# Altium project SSL_Kicker_Board_2024.PrjPcb
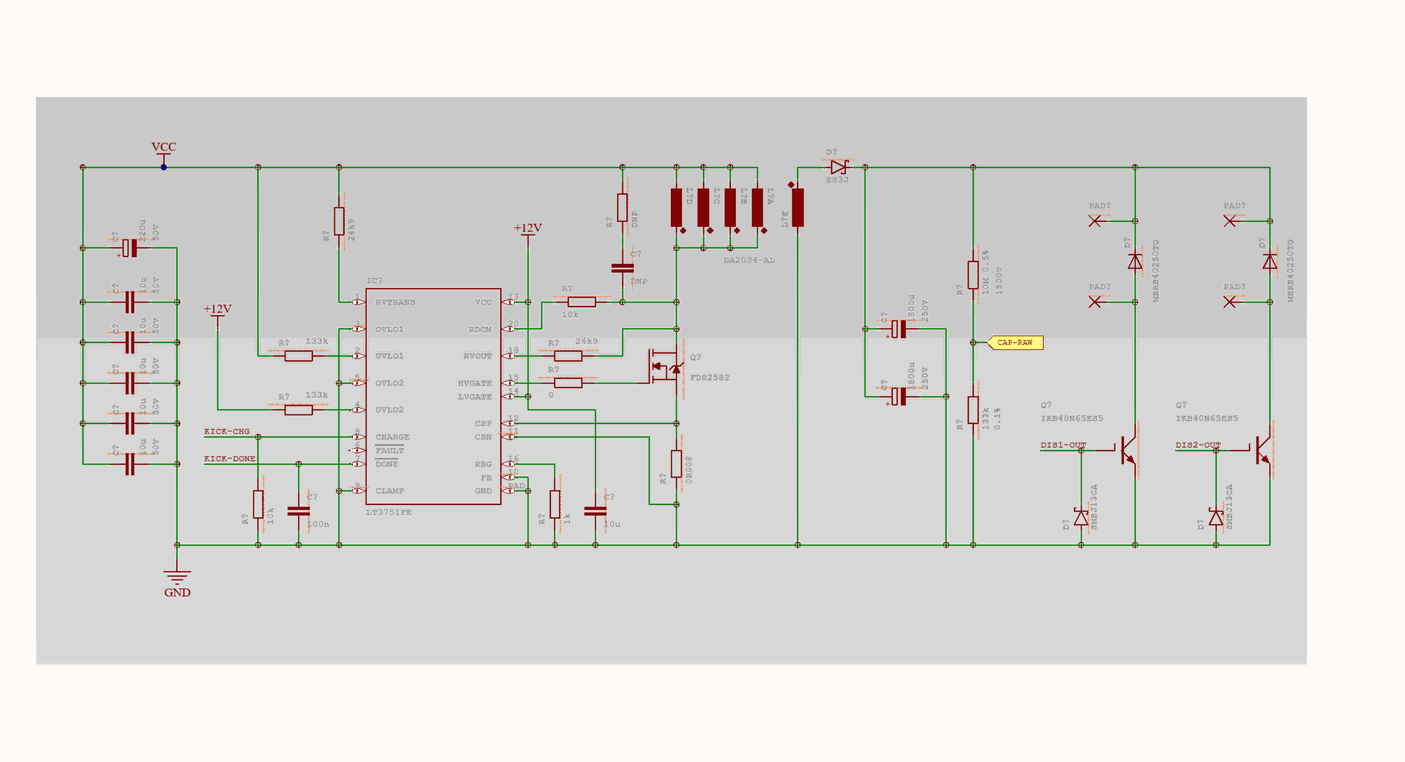
[diagram p0: Kicker.SchDoc, left]
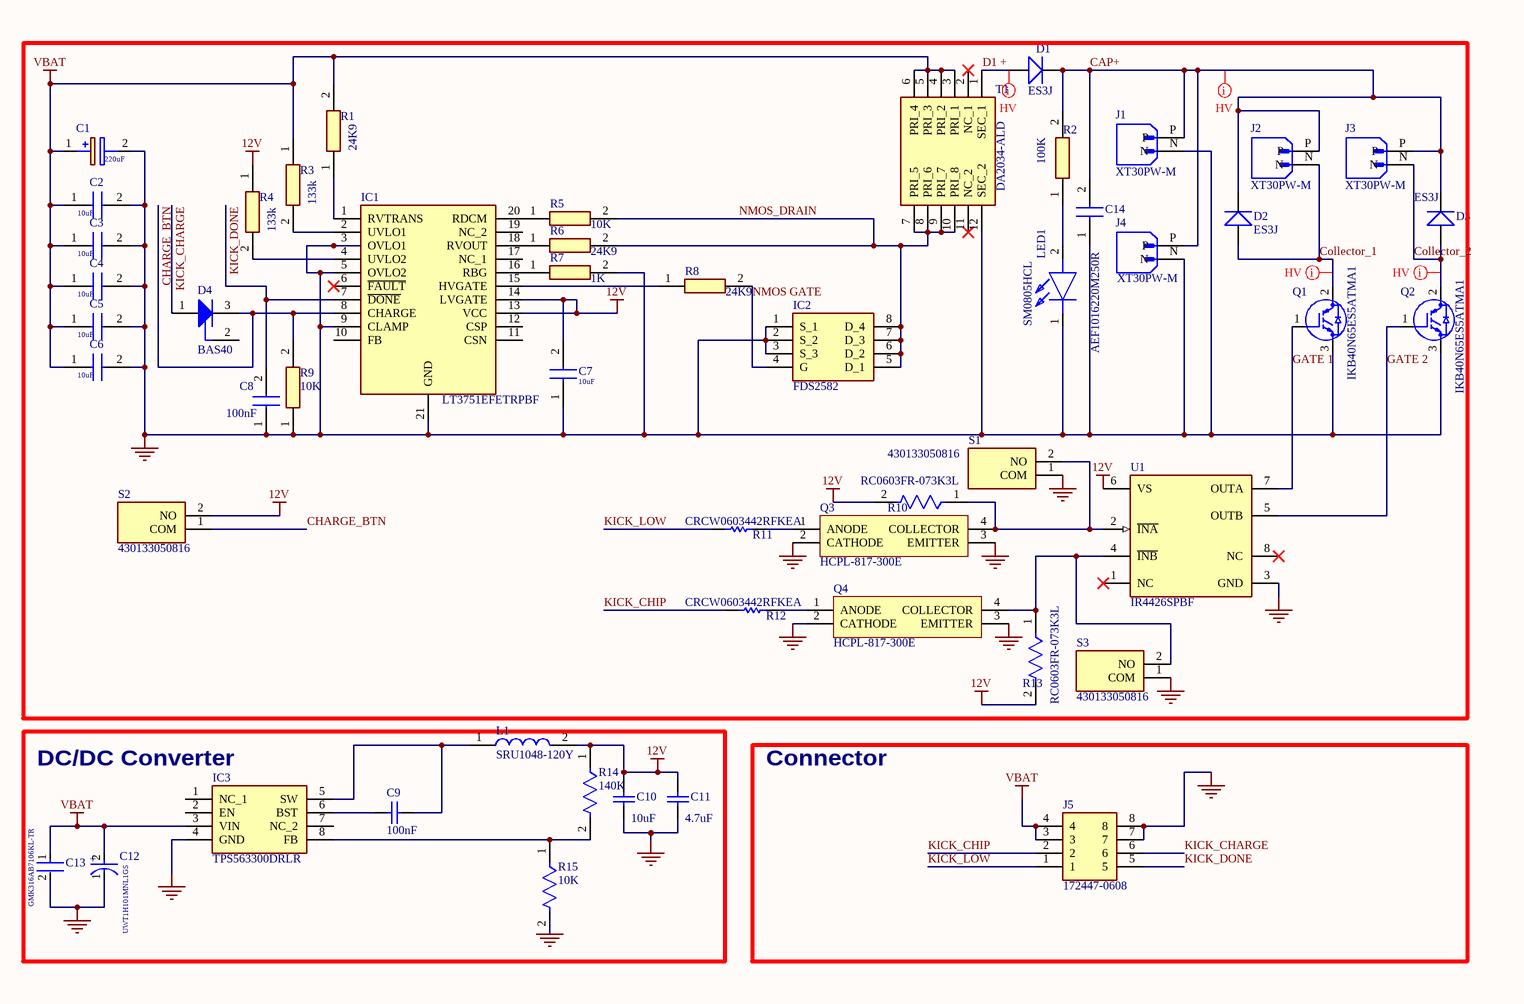
[diagram p1: Kicker.SchDoc, right]
1 sheet, 52 parts. Net scope: global (net labels, ports and power ports of the same name join across sheets).
Board file: Kicker.PcbDoc

## Sheet Kicker.SchDoc
size A4; SheetNumber: 1; SheetTotal: 1

### Parts
C1  220uF  [CAPAE1030X1050N]
C2  10uF  [CAPC2012X145N]
C3  10uF  [CAPC2012X145N]
C4  10uF  [CAPC2012X145N]
C5  10uF  [CAPC2012X145N]
C6  10uF  [CAPC2012X145N]
C7  10uF  [CAPC2012X145N]
C8  100nF  [CAPC1608X95N]
C9  100nF  [CAPC0805(2012)155_L]
C10  10uF  [CAPC0805(2012)155_L]
C11  4.7uF  [CAPC0805(2012)155_L]
C12  UWT1H101MNL1GS  [FP-UWT1H101MNL1GS-MFG]
C13  GMK316AB7106KL-TR  [FP-1206-L_3_2_0_2-W_1_6_0-IPC_C]
C14  AEF1016220M250R  [CAPAE1030X1700N]
D1  ES3J  [Diode]
D2  ES3J  [Diode]
D3  ES3J  [Diode]
D4  BAS40  [INF-SOT23_L]
IC1  LT3751EFETRPBF  [SOP65P640X120-21N]
IC2  FDS2582  [SOIC127P600X175-8N]
IC3  TPS563300DRLR  [SOTFL50P160X60-8N]
J1  XT30PW-M  [AMASS_XT30PW-M]
J2  XT30PW-M  [AMASS_XT30PW-M]
J3  XT30PW-M  [AMASS_XT30PW-M]
J4  XT30PW-M  [AMASS_XT30PW-M]
J5  172447-0608  [172447-YY08]
L1  SRU1048-120Y  [INDP100100X51N]
LED1  SM0805HCL  [LEDC2012X105N]
Q1  IKB40N65ES5ATMA1  [BTS141TCBUMA1]
Q2  IKB40N65ES5ATMA1  [BTS141TCBUMA1]
Q3  HCPL-817-300E  [HCPL-817-300]
Q4  HCPL-817-300E  [HCPL-817-300]
R1  24K9  [ERJS03J155V]
R2  100K  [RESC1608X55N]
R3  133k  [ERJUP3]
R4  133k  [ERJUP3]
R5  10K  [RESC1608X55N]
R6  24K9  [ERJS03J155V]
R7  1K  [RESC1608X55N]
R8  24K9  [ERJS03J155V]
R9  10K  [RESC1608X55N]
R10  RC0603FR-073K3L  [FP-RC0603-0_55-MFG]
R11  CRCW0603442RFKEA  [RESC1609X50X30ML10T20]
R12  CRCW0603442RFKEA  [RESC1609X50X30ML10T20]
R13  RC0603FR-073K3L  [FP-RC0603-0_55-MFG]
R14  140K  [FP-CRCW0805-e3-MFG]
R15  10K  [FP-CRCW0805-e3-IPC_A]
S1  430133050816  [430133050816]
S2  430133050816  [430133050816]
S3  430133050816  [430133050816]
T1  DA2034-ALD  [SOP300P3000X1143-12N]
U1  IR4426SPBF  [FP-PG-DSO-8-MFG]

### Blocks framed on the sheet
DC/DC Converter: C9-C13 IC3 L1 R14 R15
Connector: J5

### Nets
12V: C7.2 C10.2 C11.2 IC1.13(VCC) IC1.14(LVGATE) L1.2 R4.1 R10.2 R13.2 R14.1 S2.2(NO) U1.6(VS)
GND: C1.2(-) C2.2 C3.2 C4.2 C5.2 C6.2 C7.1 C8.1 C10.1 C11.1 C12.1(C) C13.2 C14.1(+) IC1.3(OVLO1) IC1.5(OVLO2) IC1.9(CLAMP) IC1.21(GND) IC2.1(S_1) IC2.2(S_2) IC2.3(S_3) IC3.4(GND) J1.N J4.N J5.7 J5.8 LED1.1(K) Q1.3(E) Q2.3(E) Q3.2(CATHODE) Q3.3(EMITTER) Q4.2(CATHODE) Q4.3(EMITTER) R7.2 R9.1 R15.2 S1.1(COM) S3.1(COM) T1.12(SEC_2) U1.3(GND)
VBAT: C1.1(+) C2.1 C3.1 C4.1 C5.1 C6.1 C12.2(A) C13.1 IC3.3(VIN) J5.3 J5.4 R1.2 R3.1 T1.3(PRI_1) T1.4(PRI_2) T1.5(PRI_3) T1.6(PRI_4)
CAP+: C14.2(-) D1.D1+ D2.D1+ D3.D1+ J1.P J2.P J3.P J4.P R2.2
CHARGE_BTN: D4.3(K) IC1.8(CHARGE) R9.2 S2.1(COM)
Collector_1: D2.D1- J2.N Q1.2(C)
Collector_2: D3.D1- J3.N Q2.2(C)
D1 +: D1.D1- T1.1(SEC_1)
GATE 1: Q1.1(G) U1.7(OUTA)
GATE 2: Q2.1(G) U1.5(OUTB)
KICK_CHARGE: D4.1(A) J5.6
KICK_CHIP: J5.2 R12.1
KICK_DONE: C8.2 IC1.7(~{DONE}) J5.5
KICK_LOW: J5.1 R11.1
NMOS GATE: IC2.4(G) R8.2
NMOS_DRAIN: IC2.5(D_1) IC2.6(D_2) IC2.7(D_3) IC2.8(D_4) R5.2 R6.2 T1.7(PRI_5) T1.8(PRI_6) T1.9(PRI_7) T1.10(PRI_8)
NetC9_1: C9.1 IC3.5(SW) L1.1
NetC9_2: C9.2 IC3.6(BST)
NetIC1_1: IC1.1(RVTRANS) R1.1
NetIC1_2: IC1.2(UVLO1) R3.2
NetIC1_4: IC1.4(UVLO2) R4.2
NetIC1_15: IC1.15(HVGATE) R8.1
NetIC1_16: IC1.16(RBG) R7.1
NetIC1_18: IC1.18(RVOUT) R6.1
NetIC1_20: IC1.20(RDCM) R5.1
NetIC3_8: IC3.8(FB) R14.2 R15.1
NetLED1_2: LED1.2(A) R2.1
NetQ3_1: Q3.1(ANODE) R11.2
NetQ3_4: Q3.4(COLLECTOR) R10.1 S1.2(NO) U1.2(~{INA})
NetQ4_1: Q4.1(ANODE) R12.2
NetQ4_4: Q4.4(COLLECTOR) R13.1 S3.2(NO) U1.4(~{INB})

Not connected (* = marked no-connect by the designer): D4 2(NC); IC1 6(~{FAULT})* 10(FB) 11(CSN) 12(CSP) 17(NC_1) 19(NC_2); IC3 1(NC_1) 2(EN) 7(NC_2); T1 2(NC_1)* 11(NC_2)*; U1 1(NC)* 8(NC)*

### Layout directives
net class HV: CAP+, Collector_1, Collector_2, D1 +

### Notes on the sheet
- (in symbol CMP-2000-07373-2) +

### Library data of the parts
C1 = 865080657018: Capacitor Polarised; Manufacturer_Name: Wurth Elektronik; Datasheet Link: https://www.we-online.com/catalog/datasheet/865080657018.pdf; Height: 10.5mm; Manufacturer_Part_Number: 865080657018; Mouser Part Number: 710-865080657018; Mouser Price/Stock: https://www.mouser.co.uk/ProductDetail/Wurth-Elektronik/865080657018?qs=0KOYDY2FL28CcgHzg1XTuA%3D%3D
C2-C7 = GRM21BR61H106KE43L: Capacitor 10u; Manufacturer_Name: Murata Electronics; Datasheet Link: http://www.murata.com/~/media/webrenewal/support/library/catalog/products/capacitor/mlcc/c02e.pdf; Height: 1.45mm; Manufacturer_Part_Number: GRM21BR61H106KE43L; Mouser Part Number: 81-GRM21BR61H106KE3L; Mouser Price/Stock: https://www.mouser.co.uk/ProductDetail/Murata-Electronics/GRM21BR61H106KE43L?qs=lYGu3FyN48cBZlIduWKclg%3D%3D; Arrow Part Number: GRM21BR61H106KE43L; Arrow Price/Stock: https://www.arrow.com/en/products/grm21br61h106ke43l/murata-manufacturing?region=europe
C8 = C0603C104K1RACAUTO: Capacitor; Manufacturer_Name: KEMET; Datasheet Link: https://connect.kemet.com:7667/gateway/IntelliData-ComponentDocumentation/1.0/download/specsheet/C0603C104K1RACAUTO; Height: 0.95mm; Manufacturer_Part_Number: C0603C104K1RACAUTO; Mouser Part Number: 80-C0603C104K1RAUTO; Mouser Price/Stock: https://www.mouser.co.uk/ProductDetail/KEMET/C0603C104K1RACAUTO?qs=3Rah4i%252BhyCGTQ5uPNXtfZA%3D%3D; Arrow Part Number: C0603C104K1RACAUTO; Arrow Price/Stock: https://www.arrow.com/en/products/c0603c104k1racauto/kemet-corporation?region=europe
C9-C11 = CMP-1036-04916-1: CAP 10uF 6.3V ±10% 0805 (2012 Metric) Thickness 1.55mm SMD; Tolerance: Â±10%; Case-Metric: 2012; Case-EIA: 0805; Rated Voltage: 6.3 V; Technology: SMT; Value: 10uF; Max Thickness: 1.55 mm
C12 = CMP-2000-07373-2: CAP ALUM 100UF 20% 50V SMD; Leakage Current: 3uA; Ripple Current: 140mA; Life (Hours): 1000Hour; Dissipation Factor: 0.14%; Dielectric Material: Aluminium; Termination: SMD/SMT; Tolerance: 20%; Package Quantity: 500; Capacitance: 100uF; Height: 10mm; REACH SVHC: No SVHC; Case/Package: Radial; Series: WT; Diameter: 8mm; Voltage Rating: 50V; Construction: Cylindrical; Length: 10mm; Min Operating Temperature: -55°C; Max Operating Temperature: 105°C; Voltage Rating (DC): 50V; Packaging: Tape and Reel; Voltage: 50V; Mount: Surface Mount; Ripple Current (AC): 140mA; Radiation Hardening: No; Number of Pins: 2; Lead Free: Lead Free; Height - Seated (Max): 0.413inch; RoHS Compliant: Yes; Value: 100uF
C13 = CMP-2000-06324-3: None; Voltage Rating (DC): 35V; Capacitance: 10uF; Tolerance: 10%; Dielectric: X7R; Value: 10uF; Thickness: 0.071inch; Mount: Surface Mount; Case Code (Imperial): 1206; RoHS Compliant: Yes; Voltage Rating: 35V; Case Code (Metric): 3216; Height: 1.6mm; Packaging: Tape and Reel; Resistor Type: Ceramic; REACH SVHC: No SVHC; Max Operating Temperature: 125°C; Termination: SMD/SMT; Package Quantity: 2000; Width: 1.6mm; Case/Package: 1206; Length: 0.126inch; Series: M; Min Operating Temperature: -55°C
C14 = AEF1016220M250R: Capacitor; Manufacturer_Name: KYOCERA; Datasheet Link: https://hu.mouser.com/datasheet/2/40/kyocera_avx_aef_series-2933561.pdf; Height: 17mm; Manufacturer_Part_Number: AEF1016220M250R; Mouser Part Number: 581-AEF1016220M250R; Mouser Price/Stock: https://www.mouser.co.uk/ProductDetail/KYOCERA-AVX/AEF1016220M250R?qs=MyNHzdoqoQJxz8ZnBhkLWA%3D%3D
D4 = CMP-1182-00023-1: Silicon Schottky Diode, -55 to 150 degC, SOT23, Reel, Green; Manufacturer: Infineon; IF (max): 120Â mA; Configuration: Single; VR (max): 40Â V; Green: TRUE; VF (max): 1,000Â mV; CT (max): 5Â pF; PackageDescription: 3-Pin Small Outline Transistor Package, 1.3 x 2.9 mm Body, 0.95 mm Pitch; ComponentLink3Description: Package Specification; Mounting Technology: Surface Mount; PackageVersion: Apr-08; ComponentLink1Description: Manufacturer URL; ComponentLink1URL: http://www.infineon.com/; ComponentLink2URL: http://www.infineon.com/dgdl/bas40_bas140series.pdf?folderId=db3a30431400ef68011425f1ca2505e3&fileId=db3a304314dca389011518a57ed20e11; PartNumber: BAS40; ComponentLink2Description: Datasheet; PackageReference: SOT23; ComponentLink3URL: http://www.infineon.com/dgdl/SOT23-Package_Overview.pdf?folderId=db3a30431936bc4b0119532290053c66&fileId=db3a30431936bc4b0119533468123c85; Packing: Reel
IC1 = LT3751EFETRPBF: Integrated Circuit; Manufacturer_Name: Analog Devices; Datasheet Link: https://www.mouser.in/datasheet/2/609/3751fd-1269554.pdf; Height: 1.2mm; Manufacturer_Part_Number: LT3751EFETRPBF
IC2 = FDS2582: Integrated Circuit; Manufacturer_Name: onsemi; Datasheet Link: https://www.onsemi.com/pub/Collateral/FDS2582-D.pdf; Height: 1.75mm; Manufacturer_Part_Number: FDS2582; Mouser Part Number: 512-FDS2582; Mouser Price/Stock: https://www.mouser.co.uk/ProductDetail/ON-Semiconductor-Fairchild/FDS2582/?qs=9%2FFjV4%2Fi8epQRusZUcRtHQ%3D%3D; Arrow Part Number: FDS2582; Arrow Price/Stock: https://www.arrow.com/en/products/fds2582/on-semiconductor
IC3 = TPS563300DRLR: Integrated Circuit; Manufacturer_Name: Texas Instruments; Datasheet Link: https://www.ti.com/lit/ds/symlink/tps563300.pdf?ts=1666035990155&ref_url=https%253A%252F%252Fwww.ti.com%252Fproduct%252FTPS563300; Height: 0.6mm; Manufacturer_Part_Number: TPS563300DRLR; Mouser Part Number: 595-TPS563300DRLR; Mouser Price/Stock: https://www.mouser.co.uk/ProductDetail/Texas-Instruments/TPS563300DRLR?qs=vvQtp7zwQdMDxJAw0dSlAg%3D%3D
J1-J4 = XT30PW-M: Socket; DC supply; XT30; male; PIN: 2; on PCBs; THT; Colour: yellow; MF: AMASS; Package: None; Price: None; Value: *; SnapEDA_Link: https://www.snapeda.com/parts/XT30PW-M/AMASS/view-part/?ref=snap; MP: XT30PW-M; Availability: Not in stock; Check_prices: https://www.snapeda.com/parts/XT30PW-M/AMASS/view-part/?ref=eda
J5 = 172447-0608: Connector; Manufacturer_Name: Molex; Datasheet Link: https://www.molex.com/pdm_docs/sd/1724470406_sd.pdf; Height: 12.8mm; Manufacturer_Part_Number: 172447-0608; Mouser Part Number: 538-172447-0608; Mouser Price/Stock: https://www.mouser.co.uk/ProductDetail/Molex/172447-0608?qs=t7xnP681wgUaroQMnMhOkA%3D%3D
L1 = SRU1048-120Y: Inductor 12uH 4A; Manufacturer_Name: TDK; Manufacturer_Part_Number: CLF7045T-4R7N-D; Datasheet Link: https://product.tdk.com/system/files/dam/doc/product/inductor/inductor/smd/wdcatalog/withdrawn_inductor_commercial_power_clf7045_en.pdf; Height: 4.8mm; Mouser Part Number: 810-CLF7045T-4R7N-D; Mouser Price/Stock: https://www.mouser.co.uk/ProductDetail/TDK/CLF7045T-4R7N-D?qs=ilIqL0%2F%2FoDU8gjMEHwFGUQ%3D%3D; Arrow Part Number: CLF7045T-4R7N-D; Arrow Price/Stock: https://www.arrow.com/en/products/clf7045t-4r7n-d/tdk
LED1 = SM0805HCL: LED; Manufacturer_Name: Bivar; Datasheet Link: https://datasheet.datasheetarchive.com/originals/distributors/Datasheets-28/DSA-548818.pdf; Height: 1.054mm; Manufacturer_Part_Number: SM0805HCL; Mouser Part Number: 749-SM0805HCL; Mouser Price/Stock: https://www.mouser.co.uk/ProductDetail/Bivar/SM0805HCL?qs=jaLxTFIJCiunRhy8mE7Amw%3D%3D; Arrow Part Number: SM0805HCL; Arrow Price/Stock: https://www.arrow.com/en/products/sm0805hcl/bivar?region=nac
Q1 Q2 = IKB40N65ES5ATMA1: Transistor IGBT; Manufacturer_Name: Infineon; Datasheet Link: https://componentsearchengine.com/Datasheets/1/IKB40N65ES5ATMA1.pdf; Height: 4.4mm; Manufacturer_Part_Number: IKB40N65ES5ATMA1; Mouser Part Number: 726-IKB40N65ES5ATMA1; Mouser Price/Stock: https://www.mouser.co.uk/ProductDetail/Infineon-Technologies/IKB40N65ES5ATMA1?qs=MLItCLRbWsxz7jtfFbVz2w%3D%3D; Arrow Part Number: IKB40N65ES5ATMA1; Arrow Price/Stock: https://www.arrow.com/en/products/ikb40n65es5atma1/infineon-technologies-ag?region=nac
R1 R6 R8 = ERJ-U03F2492V: Resistor; Manufacturer_Name: Panasonic; Datasheet Link: http://industrial.panasonic.com/cdbs/www-data/pdf/RDP0000/AOA0000C334.pdf; Height: 0.55mm; Manufacturer_Part_Number: ERJ-U03F2492V; Mouser Part Number: 667-ERJ-U03F2492V; Mouser Price/Stock: https://www.mouser.co.uk/ProductDetail/Panasonic/ERJ-U03F2492V?qs=pdFhdcvjjggoxhbYOGQCqA%3D%3D
R2 = CPF0603F100KC1: Resistor; Manufacturer_Name: TE Connectivity; Datasheet Link: http://www.farnell.com/datasheets/1786775.pdf; Height: 0.55mm; Manufacturer_Part_Number: CPF0603F100KC1; Mouser Part Number: 279-CPF0603F100KC1; Mouser Price/Stock: https://www.mouser.co.uk/ProductDetail/TE-Connectivity-Holsworthy/CPF0603F100KC1?qs=n4i9pByFsMRwvDu9p24AYA%3D%3D; Arrow Part Number: CPF0603F100KC1; Arrow Price/Stock: https://www.arrow.com/en/products/cpf0603f100kc1/te-connectivity?region=nac
R3 R4 = ERJ-UP3F1333V: Resistor; Manufacturer_Name: Panasonic; Datasheet Link: https://industrial.panasonic.com/cdbs/www-data/pdf/RDP0000/AOA0000C337.pdf; Height: 0.55mm; Manufacturer_Part_Number: ERJ-UP3F1333V; Mouser Part Number: 667-ERJ-UP3F1333V; Mouser Price/Stock: https://www.mouser.co.uk/ProductDetail/Panasonic/ERJ-UP3F1333V?qs=GedFDFLaBXHzgPg3lbsA%252Bw%3D%3D
R5 R9 = ERJ-U3RD1002V: Resistor; Manufacturer_Name: Panasonic; Datasheet Link: https://industrial.panasonic.com/cdbs/www-data/pdf/RDP0000/RDP0000C343.pdf; Height: 0.55mm; Manufacturer_Part_Number: ERJ-U3RD1002V; Mouser Part Number: 667-ERJ-U3RD1002V; Mouser Price/Stock: https://www.mouser.co.uk/ProductDetail/Panasonic/ERJ-U3RD1002V?qs=TiOZkKH1s2Rg0qUjKdWcPw%3D%3D; Arrow Part Number: ERJ-U3RD1002V; Arrow Price/Stock: https://www.arrow.com/en/products/erj-u3rd1002v/panasonic?region=nac
R7 = CHP0603QFX-1001ELF: Resistor; Manufacturer_Name: Bourns; Datasheet Link: http://www.bourns.com/docs/Product-Datasheets/CHP-Q.pdf; Height: 0.55mm; Manufacturer_Part_Number: CHP0603QFX-1001ELF; Mouser Part Number: 652-CHP0603QFX-1001E; Mouser Price/Stock: https://www.mouser.co.uk/ProductDetail/Bourns/CHP0603QFX-1001ELF?qs=8Wlm6%252BaMh8TVmVuLViesjw%3D%3D; Arrow Part Number: CHP0603QFX-1001ELF; Arrow Price/Stock: https://www.arrow.com/en/products/chp0603qfx-1001elf/bourns?region=nac
R10 R13 = CMP-1012-00567-3: NexarPartId: 40011875; Tolerance: 1%; Power Rating: 100mW; Temperature Coefficient: 100ppm/°C; Voltage Rating (DC): 50V; Resistance: 3.3kΩ; Value: 3.3kΩ; Military Standard: Not; Case/Package: 0603; Mount: Surface Mount; Lead Free: Lead Free; Packaging: Tape & Reel; Termination: SMD/SMT; Number of Terminations: 2; Composition: Thick Film; Length: 1.6mm; Max Power Dissipation: 100mW; Width: 800µm; Features: Moisture Resistant; Max Operating Temperature: 155°C; Depth: 800µm; Number of Pins: 2; REACH SVHC: No SVHC; Case Code (Imperial): 0603; Case Code (Metric): 0603; RoHS: Compliant; Voltage Rating (AC): 50V; Voltage Rating: 50V; Schedule B: 8533210045, 8533210045; Min Operating Temperature: -55°C; Height: 450µm
R11 R12 = CMP-1012-00470-2: Manufacturer: Vishay Dale; Part Number: CRCW0603442RFKEA
R14 = CMP-2001-03804-2: RES Thick Film, 30kΩ, 1%, 0.125W, 100ppm/°C, 0805; Max Power Dissipation: 125mW; Voltage Rating (DC): 150V; Resistance: 30kR; Value: 30kR; Contact Plating: Tin; Weight: 0.000194oz; Temperature Coefficient: 100ppm/°C; Packaging: Tape and Reel; Height: 0.45mm; Case Code (Imperial): 0805; Max Operating Temperature: 155°C; Case/Package: 0805; Package Quantity: 10; Case Code (Metric): 2012; Features: Automotive AEC-Q200; Mount: Surface Mount; Length: 2mm; Termination: SMD/SMT; Lead Free: Lead Free; Width: 0.049inch; Number of Pins: 2; Depth: 1.25mm; Min Operating Temperature: -55°C; Power Rating: 125mW; Voltage Rating: 150V; Military Standard: Not; Composition: Thick Film; Tolerance: 1%; Number of Terminations: 2; Radiation Hardening: No
R15 = CMP-2001-04908-2: RES Thick Film, 10kΩ, 1%, 0.125W, 100ppm/°C, 0805; Resistance: 10kR; Voltage Rating (DC): 150V; Power Rating: 125mW; Value: 10kR; Weight: 0.000194oz; Package Quantity: 5000; Military Standard: Not; Max Operating Temperature: 155°C; Temperature Coefficient: 100ppm/°C; Contact Plating: Tin; Width: 1.25mm; Height: 0.45mm; Radiation Hardening: No; Tolerance: 1%; Min Operating Temperature: -55°C; Voltage Rating: 150V; Length: 2mm; Depth: 1.25mm; Termination: SMD/SMT; Packaging: Tape and Reel; Case/Package: 0805; Case Code (Metric): 2012; Lead Free: Lead Free; Case Code (Imperial): 0805; Composition: Thick Film
S1-S3 = 430133050816: Switch; Manufacturer_Name: Wurth Elektronik; Datasheet Link: https://www.we-online.com/components/products/datasheet/430133050816.pdf; Height: 5.2mm; Manufacturer_Part_Number: 430133050816; Mouser Part Number: 710-430133050816; Mouser Price/Stock: https://www.mouser.co.uk/ProductDetail/Wurth-Elektronik/430133050816?qs=ufv2HEpFn%252BRy3i84BABEDg%3D%3D
T1 = DA2034-ALD: Transformer; Manufacturer_Name: COILCRAFT; Datasheet Link: https://www.coilcraft.com/pdfs/da2032.pdf; Height: 11.43mm; Manufacturer_Part_Number: DA2034-ALD; Mouser Part Number: 994-DA2034-ALD; Mouser Price/Stock: https://www.mouser.co.uk/ProductDetail/Coilcraft/DA2034-ALD?qs=ZYnrCdKdyedtN304hL7iMg%3D%3D
U1 = CMP-32851-000176-1: IC GATE DRVR LOW-SIDE 8SOIC; Max Supply Voltage: 20V; Min Supply Voltage: 6V; Channel Type: Independent; Number of Drivers: 2; Output Current: 3.3A; Propagation Delay: 85ns; Fall Time: 25ns; Reach SVHC Compliant: Yes; RoHS Compliant: Yes; Width: 0.157inch; Halogen Free: Not Halogen Free; Max Operating Temperature: 150°C; Number of Outputs: 2; Packaging: Rail/Tube; Number of Pins: 8; Number of Channels: 2; Case/Package: SOIC; Max Output Current: 3.3A; Package Quantity: 95; Height: 0.059inch; Series: -; Min Operating Temperature: -40°C; Lead Free: Lead Free; Mount: Surface Mount; Length: 0.196inch
Q3 Q4 = HCPL-817-300E: Manufacturer_Part_Number: HCPL-817-300E